# Altium schematic sheet MCU_stm32f103c8t6.SchDoc
size 381 x 241 mm; SheetNumber: 1; SheetTotal: 5
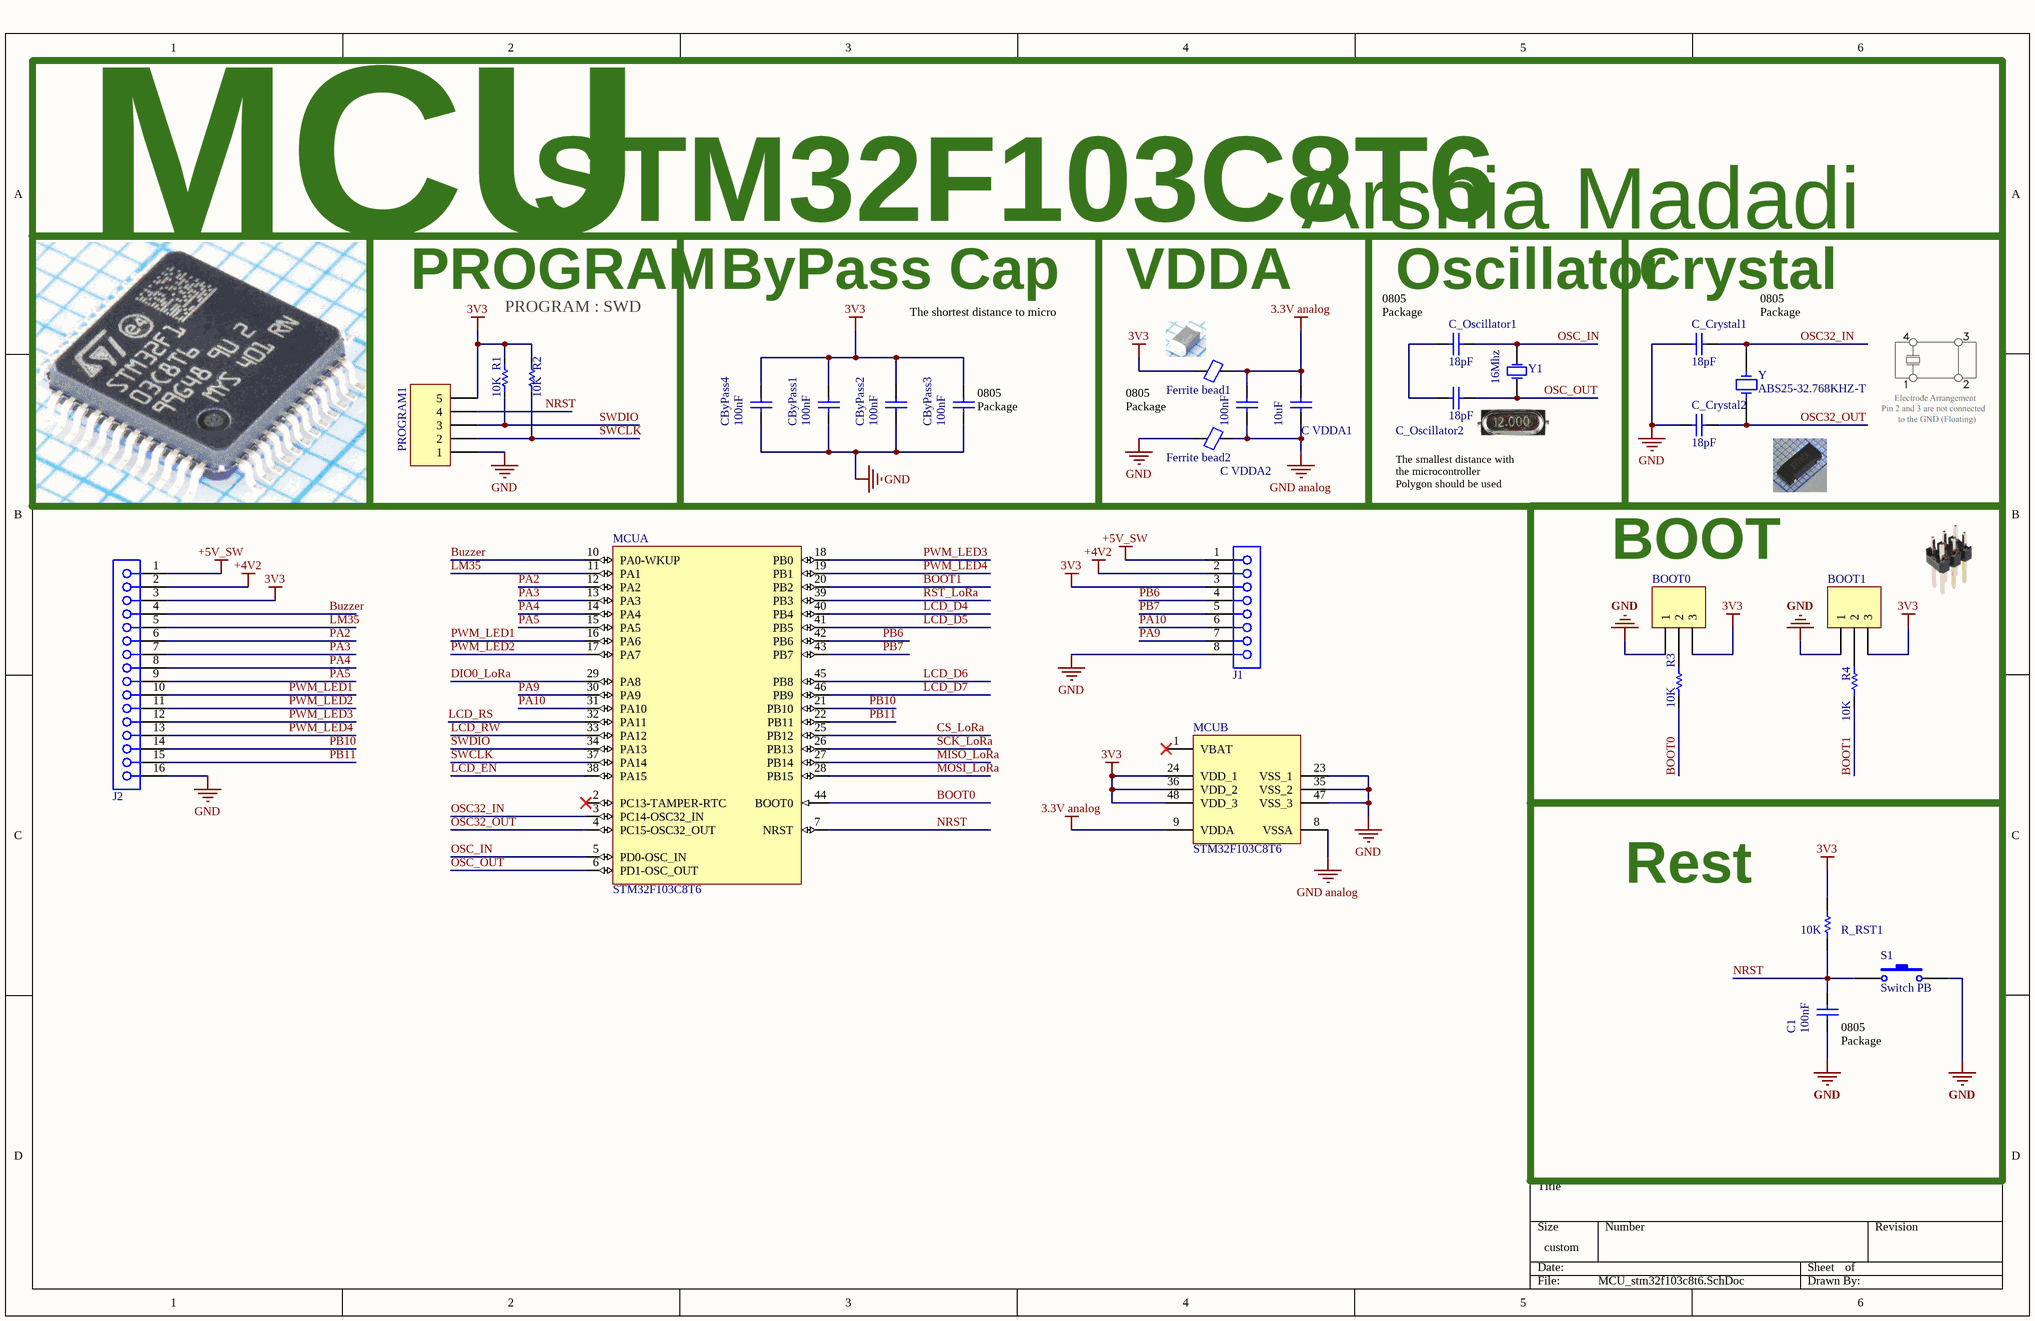
[diagram p0: MCU_stm32f103c8t6.SchDoc]

## Parts
BOOT0  Header 3  [My_1X03]  (value not drawn)
BOOT1  Header 3  [My_1X03]  (value not drawn)
C1  100nF  [MY_CAP_SMD_0805]
C_Crystal1  18pF  [MY_CAP_SMD_0805]
C_Crystal2  18pF  [MY_CAP_SMD_0805]
C_Oscillator1  18pF  [MY_CAP_SMD_0805]
C_Oscillator2  18pF  [MY_CAP_SMD_0805]
C_VDDA1  10uF  [MY_CAP_SMD_0805]
C_VDDA2  100nF  [MY_CAP_SMD_0805]
CByPass1  100nF  [MY_CAP_SMD_0805]
CByPass2  100nF  [MY_CAP_SMD_0805]
CByPass3  100nF  [MY_CAP_SMD_0805]
CByPass4  100nF  [MY_CAP_SMD_0805]
Ferrite_bead1  Ferrite Bead SMD  [FB1206]  (value not drawn)
Ferrite_bead2  Ferrite Bead SMD  [FB1206]  (value not drawn)
J1  61300811821  [61300811821]  (value not drawn)
J2  61301611821  [61301611821]  (value not drawn)
MCU  STM32F103C8T6  [STM-LQFP48_M]  (parts A,B of 2)
PROGRAM1  Header 5  [My_1X05]  (value not drawn)
R1  10K  [1206_Res]
R2  10K  [1206_Res]
R3  10K  [RESC4817X04N]
R4  10K  [RESC4817X04N]
R_RST1  10K  [RESC4817X04N]
S1  Switch PB  [SW-PB]
Y  ABS25-32.768KHZ-T  [XTAL_ABS25-32.768KHZ-6-1-T]
Y1  16Mhz  [Crystal]

## Blocks framed on the sheet
MCU: C_Crystal1 C_Crystal2 C_Oscillator1 C_Oscillator2 C_VDDA1 C_VDDA2 CByPass1-CByPass4 Ferrite_bead1 Ferrite_bead2 PROGRAM1 R1 R2 Y Y1
BOOT: BOOT0 BOOT1 R3 R4
Rest: C1 R_RST1 S1

## Nets
3.3V analog: C_VDDA1.2 C_VDDA2.2 Ferrite_bead1.2 MCU.9(VDDA)
3V3: BOOT0.3 BOOT1.3 CByPass1.2 CByPass2.2 CByPass3.2 CByPass4.2 Ferrite_bead1.1 J1.3 J2.3 MCU.24(VDD_1) MCU.36(VDD_2) MCU.48(VDD_3) PROGRAM1.5 R1.2 R2.2 R_RST1.2
+4V2: J1.2 J2.2
+5V_SW: J1.1 J2.1
GND: BOOT0.1 BOOT1.1 C1.1 C_Crystal1.2 C_Crystal2.2 CByPass1.1 CByPass2.1 CByPass3.1 CByPass4.1 Ferrite_bead2.1 J1.8 J2.16 MCU.23(VSS_1) MCU.35(VSS_2) MCU.47(VSS_3) PROGRAM1.1 S1.2
GND analog: C_VDDA1.1 C_VDDA2.1 Ferrite_bead2.2 MCU.8(VSSA)
BOOT0: MCU.44(BOOT0) R3.1
BOOT1: MCU.20(PB2) R4.1
Buzzer: J2.4 MCU.10(PA0-WKUP)
CS_LoRa: MCU.25(PB12)
DIO0_LoRa: MCU.29(PA8)
LCD_D4: MCU.40(PB4)
LCD_D5: MCU.41(PB5)
LCD_D6: MCU.45(PB8)
LCD_D7: MCU.46(PB9)
LCD_EN: MCU.38(PA15)
LCD_RS: MCU.32(PA11)
LCD_RW: MCU.33(PA12)
LM35: J2.5 MCU.11(PA1)
MISO_LoRa: MCU.27(PB14)
MOSI_LoRa: MCU.28(PB15)
NRST: C1.2 MCU.7(NRST) PROGRAM1.4 R_RST1.1 S1.1
OSC32_IN: C_Crystal1.1 MCU.3(PC14-OSC32_IN) Y.4
OSC32_OUT: C_Crystal2.1 MCU.4(PC15-OSC32_OUT) Y.1
OSC_IN: C_Oscillator1.1 MCU.5(PD0-OSC_IN) Y1.2(OSC2)
OSC_OUT: C_Oscillator2.1 MCU.6(PD1-OSC_OUT) Y1.1(OSC1)
PA2: J2.6 MCU.12(PA2)
PA3: J2.7 MCU.13(PA3)
PA4: J2.8 MCU.14(PA4)
PA5: J2.9 MCU.15(PA5)
PA9: J1.7 MCU.30(PA9)
PA10: J1.6 MCU.31(PA10)
PB6: J1.4 MCU.42(PB6)
PB7: J1.5 MCU.43(PB7)
PB10: J2.14 MCU.21(PB10)
PB11: J2.15 MCU.22(PB11)
PWM_LED1: J2.10 MCU.16(PA6)
PWM_LED2: J2.11 MCU.17(PA7)
PWM_LED3: J2.12 MCU.18(PB0)
PWM_LED4: J2.13 MCU.19(PB1)
RST_LoRa: MCU.39(PB3)
SCK_LoRa: MCU.26(PB13)
SWCLK: MCU.37(PA14) PROGRAM1.2 R2.1
SWDIO: MCU.34(PA13) PROGRAM1.3 R1.1
NetBOOT0_2: BOOT0.2 R3.2
NetBOOT1_2: BOOT1.2 R4.2
NetC_Oscillator1_2: C_Oscillator1.2 C_Oscillator2.2

Not connected (* = marked no-connect by the designer): MCU 1(VBAT)* 2(PC13-TAMPER-RTC)*

## Notes on the sheet
- STM32F103C8T6
- Arshia Madadi
- PROGRAM
- PROGRAM : SWD
- ByPass Cap
- VDDA
- (near C_Oscillator1) 0805 Package
- Oscillator
- (near C_Crystal1) Crystal
- 0805 Package
- The shortest distance to micro
- (near CByPass3) 0805 Package
- The smallest distance with the microcontroller
  Polygon should be used
- (near C1) 0805 Package

## Library data of the parts
BOOT0 BOOT1 = Header 3: Header, 3-Pin; LatestRevisionDate: 17-Jul-2002; LatestRevisionNote: Re-released for DXP Platform.; Publisher: Altium Limited
C1 C_Crystal1 C_Crystal2 C_Oscillator1 C_Oscillator2 C_VDDA1 C_VDDA2 CByPass1-CByPass4 = CAP SMD_0805: 2.0 mm × 1.25 mm
Ferrite_bead1 Ferrite_bead2 = Ferrite Bead SMD Package: Designer: Ali Hafizi
J1 = 61300811821: WR-PHD Socket Header, THT, Vertical, pitch 2.54mm, 1 Row, 8P; Manufacturer: Wurth Elektronik; Contact Resistance: 20mOhm; Rated Current: 3A; Working Voltage: 250V; Withstanding Voltage: 500V; Manufacturer Part Number: 61300811821; Category: Board-to-Board Connectors; Match Code: WR-PHD; ComponentLink1Description: Website Link; ComponentLink1URL: https://www.we-online.com/redexpert/article/61300811821?ad; ComponentLink2Description: Datasheet Link; ComponentLink2URL: https://www.we-online.com/redexpert/spec/61300811821?ad; Mount: Through Hole; Operating Temperature Max: 125°C; Operating Temperature Min: -40°C; Packaging: Tray; Gender: Socket Header; Number of Pins: 8; Number of Rows: 1; Orientation: Vertical; Pitch: 2.54mm
J2 = 61301611821: WR-PHD Socket Header, THT, Vertical, pitch 2.54mm, 1 Row, 16P; Manufacturer: Wurth Elektronik; Contact Resistance: 20mOhm; Rated Current: 3A; Working Voltage: 250V; Withstanding Voltage: 500V; Manufacturer Part Number: 61301611821; Category: Board-to-Board Connectors; Match Code: WR-PHD; ComponentLink1Description: Website Link; ComponentLink1URL: https://www.we-online.com/redexpert/article/61301611821?ad; ComponentLink2Description: Datasheet Link; ComponentLink2URL: https://www.we-online.com/redexpert/spec/61301611821?ad; Mount: Through Hole; Operating Temperature Max: 105°C; Operating Temperature Min: -40°C; Packaging: Tray; Gender: Socket Header; Number of Pins: 16; Number of Rows: 1; Orientation: Vertical; Pitch: 2.54mm
MCU = STM32F103C8T6: ARM Cortex-M3 32-bit MCU, 64 KB Flash, 20 KB Internal RAM, 37 I/Os, 48-pin LQFP, -40 to 85 degC, Tray; A/D Converter: 2x12-bit (10 Channel); FLASH Size (Prog) (kB): 64; I/Os (High Current): 37; Internal RAM Size (kB): 20; Operating Frequency(F) (Processor speed) (MHz): 72; Supply Voltage(Vcc) min (V): 2; DatasheetVersion: Rev. 16; PackageVersion: Rev. 6, 06/2013; PackageReference: LQFP48; PackageDescription: 48-Pin Low Profile Quad Flat Package, 7 x 7 mm Body, 0.5 mm Pitch; Supplier 1: Digi-Key; Supplier Part Number 1: 497-6063-ND; Supplier 2: Farnell; Supplier Part Number 2: 1447637; Supplier 3: Newark; Supplier Part Number 3: 59M2182; Supplier 4: Newark; Supplier Part Number 4: 57P1222; Supplier 5: Mouser; Supplier Part Number 5: 511-STM32F103C8T6; Core: ARM Cortex-M3; Packing: Tray; Mounting Technology: Surface Mount; PartNumber: STM32F103C8T6; ComponentLink1Description: Manufacturer URL; ComponentLink1URL: http://www.st.com/web/en/home.html; ComponentLink2Description: Datasheet; ComponentLink2URL: http://www.st.com/st-web-ui/static/active/en/resource/technical/document/datasheet/CD00161566.pdf; ComponentLink3Description: Package Specification; ComponentLink3URL: http://www.st.com/st-web-ui/static/active/en/resource/technical/document/datasheet/DM00058181.pdf
PROGRAM1 = Header 5: Header, 5-Pin; LatestRevisionDate: 17-Jul-2002; LatestRevisionNote: Re-released for DXP Platform.; Publisher: Altium Limited
R1 R2 = Res: Resistor; Published: 8-Jun-2000; LatestRevisionDate: 17-Jul-2002; LatestRevisionNote: Re-released for DXP Platform.; PackageReference: AXIAL-0.3; Publisher: Altium Limited
R3 R4 R_RST1 = RES 1206 0.25W: RES 1206; Designer: Abbas Basereh; Desc.: RES SMD 1206; Data: 16-12-2016
S1 = Switch PB: Push Button Switch
Y = ABS25-32.768KHZ-T: 32.768kHz Â±20ppm Crystal 12.5pF 50 kOhms 4-SOJ, 5.50mm pitch; MF: Abracon LLC; Package: 4-4 Abracon LLC; MP: ABS25-32.768KHZ; Value: *; Availability: Unavailable; Price: None; SnapEDA_Link: https://www.snapeda.com/parts/ABS25-32.768KHZ/Abracon%20LLC/view-part/478888/?ref=snap
Y1 = XTAL: Crystal Oscillator; Published: 8-Jun-2000; LatestRevisionDate: 17-Jul-2002; LatestRevisionNote: Re-released for DXP Platform.; PackageReference: R38; Publisher: Altium Limited